# Altium schematic sheet TLV320AIC23B sch .SchDoc
size A; PageSetup: Record=PageOptions|CenterHorizontal=True|CenterVertical=True|PrintScale=1.07|XCorrection=1.00|YCorrection=1.00|PrintKind=0|BorderSize=5000000|LeftOffset=0|BottomOffset=0|Orientation=2|PaperLength=1000|PaperWidth=1000|Scale=100|PaperSource=7|PrintQuality=-4|MediaType=1|DitherType=10|PaperKind=Letter|PrintScaleMode=1
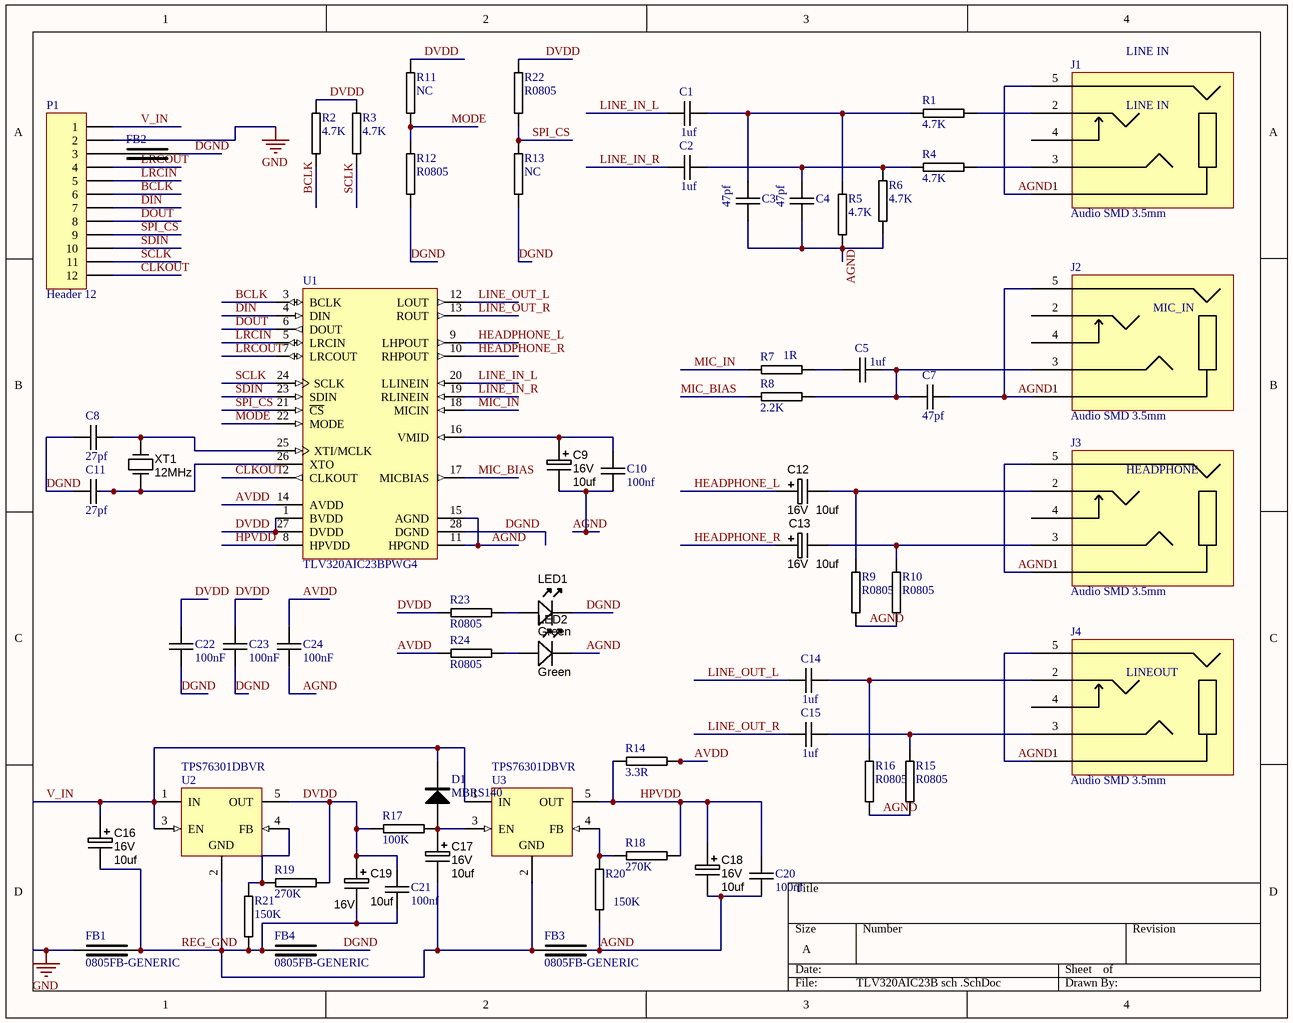
[diagram p0: TLV320AIC23B sch .SchDoc]

## Parts
C1  1uf  [0805C-GENERIC]
C2  1uf  [0805C-GENERIC]
C3  47pf  [0805C-GENERIC]
C4  47pf  [0805C-GENERIC]
C5  1uf  [0805C-GENERIC]
C7  47pf  [0805C-GENERIC]
C8  27pf  [0805C-GENERIC]
C9  Ratings: 16V  [CAPMP3528X210N]  (hidden comment: 10uf)
C10  100nf  [0805C-GENERIC]
C11  27pf  [0805C-GENERIC]
C12  Ratings: 16V  [CAPMP3528X210N]  (hidden comment: 10uf)
C13  Ratings: 16V  [CAPMP3528X210N]  (hidden comment: 10uf)
C14  1uf  [0805C-GENERIC]
C15  1uf  [0805C-GENERIC]
C16  Ratings: 16V  [CAPMP3528X210N]  (hidden comment: 10uf)
C17  Ratings: 16V  [CAPMP3528X210N]  (hidden comment: 10uf)
C18  Ratings: 16V  [CAPMP3528X210N]  (hidden comment: 10uf)
C19  Ratings: 16V  [CAPMP3528X210N]  (hidden comment: 10uf)
C20  100nf  [0805C-GENERIC]
C21  100nf  [0805C-GENERIC]
C22  100nF  [0603C-GENERIC]
C23  100nF  [0603C-GENERIC]
C24  100nF  [0603C-GENERIC]
D1  MBRS140  [DIODE-SMA]
FB1  0805FB-GENERIC  [0805FB-GENERIC]
FB2  (no value)  [0805FB-GENERIC]
FB3  0805FB-GENERIC  [0805FB-GENERIC]
FB4  0805FB-GENERIC  [0805FB-GENERIC]
J1  Audio SMD 3.5mm  [SMDAudio3.5mm]
J2  Audio SMD 3.5mm  [SMDAudio3.5mm]
J3  Audio SMD 3.5mm  [SMDAudio3.5mm]
J4  Audio SMD 3.5mm  [SMDAudio3.5mm]
LED1  Green  [LED-0805-K]
LED2  Green  [LED-0805-K]
P1  Header 12  [HDR1X12]
R1  4.7K  [0805R-GENERIC]
R2  4.7K  [0805R-GENERIC]
R3  4.7K  [0805R-GENERIC]
R4  4.7K  [0805R-GENERIC]
R5  4.7K  [0805R-GENERIC]
R6  4.7K  [0805R-GENERIC]
R7  1R  [0805R-GENERIC]
R8  2.2K  [0805R-GENERIC]
R9  R0805  [0805R-GENERIC]
R10  R0805  [0805R-GENERIC]
R11  NC  [0805R-GENERIC]
R12  R0805  [0805R-GENERIC]
R13  NC  [0805R-GENERIC]
R14  3.3R  [0805R-GENERIC]
R15  R0805  [0805R-GENERIC]
R16  R0805  [0805R-GENERIC]
R17  100K  [0805R-GENERIC]
R18  270K  [0805R-GENERIC]
R19  270K  [0805R-GENERIC]
R20  150K  [0805R-GENERIC]
R21  150K  [0805R-GENERIC]
R22  R0805  [0805R-GENERIC]
R23  R0805  [0805R-GENERIC]
R24  R0805  [0805R-GENERIC]
U1  TLV320AIC23BPWG4  [PW28_N]
U2  TPS76301DBVR  [TI-DBV5_N]
U3  TPS76301DBVR  [TI-DBV5_N]
XT1  12MHz  [CRYSTAL_HC49-US-SM]

## Nets
GND: FB1.1 P1.2
AGND: C3.1 C4.1 C7.1 C9.2 C10.2 C18.2 C20.2 C24.2 FB3.2 J1.1 J1.5 J2.1 J2.5 J3.1 J3.5 J4.1 J4.5 LED2.K R5.1 R6.1 R9.1 R10.1 R15.1 R16.1 R20.1 U1.11(HPGND) U1.15(AGND)
AVDD: C24.1 R14.2 R24.2 U1.14(AVDD)
BCLK: P1.6 R2.1 U1.3(BCLK)
CLKOUT: P1.12 U1.2(CLKOUT)
DGND: C8.1 C11.2 C22.2 C23.2 FB2.2 FB4.2 LED1.K R12.1 R13.1 U1.28(DGND)
DIN: P1.7 U1.4(DIN)
DOUT: P1.8 U1.6(DOUT)
DVDD: C19.1 C21.1 C22.1 C23.1 R2.2 R3.2 R11.2 R17.1 R19.1 R22.2 R23.2 U1.1(BVDD) U1.27(DVDD) U2.5(OUT)
HEADPHONE_L: C12.1 U1.9(LHPOUT)
HEADPHONE_R: C13.1 U1.10(RHPOUT)
HPVDD: C18.1 C20.1 R14.1 R18.1 U1.8(HPVDD) U3.5(OUT)
LINE_IN_L: C1.1 U1.20(LLINEIN)
LINE_IN_R: C2.1 U1.19(RLINEIN)
LINE_OUT_L: C14.2 U1.12(LOUT)
LINE_OUT_R: C15.2 U1.13(ROUT)
LRCIN: P1.5 U1.5(LRCIN)
LRCOUT: P1.4 U1.7(LRCOUT)
MIC_BIAS: R8.1 U1.17(MICBIAS)
MIC_IN: R7.1 U1.18(MICIN)
MODE: R11.1 R12.2 U1.22(MODE)
REG_GND: C16.2 C17.2 C19.2 C21.2 FB1.2 FB3.1 FB4.1 R21.1 U2.2(GND) U3.2(GND)
SCLK: P1.11 R3.1 U1.24(SCLK)
SDIN: P1.10 U1.23(SDIN)
SPI_CS: P1.9 R13.2 R22.1 U1.21(~{CS})
V_IN: C16.1 D1.K P1.1 U2.1(IN) U2.3(EN) U3.1(IN)
NetC1_2: C1.2 C3.2 R1.1 R5.2
NetC2_2: C2.2 C4.2 R4.1 R6.2
NetC5_1: C5.1 C7.2 J2.3 R8.2
NetC5_2: C5.2 R7.2
NetC8_2: C8.2 U1.25(XTI/MCLK) XT1.2(OUT)
NetC9_1: C9.1 C10.1 U1.16(VMID)
NetC11_1: C11.1 U1.26(XTO) XT1.1(IN)
NetC12_2: C12.2 J3.2 R9.2
NetC13_2: C13.2 J3.3 R10.2
NetC14_1: C14.1 J4.2 R16.2
NetC15_1: C15.1 J4.3 R15.2
NetC17_1: C17.1 D1.A R17.2 U3.3(EN)
NetFB2_1: FB2.1 P1.3
NetJ1_2: J1.2 R1.2
NetJ1_3: J1.3 R4.2
NetLED1_A: LED1.A R23.1
NetLED2_A: LED2.A R24.1
NetR18_2: R18.2 R20.2 U3.4(FB)
NetR19_2: R19.2 R21.2 U2.4(FB)

Not connected (* = marked no-connect by the designer): J1 4; J2 2 4; J3 4; J4 4

## Notes on the sheet
- LINE IN
- MIC_IN
- HEADPHONE
- LINEOUT

## Library data of the parts
C1-C5 C7 C8 C10 C11 C14 C15 C20 C21 = C0805-GENERIC: GENERIC CAPACITOR NON POLARISED0603
C9 C12 C13 C16-C19 = CAPT_47u_1210_6V3: Capacitor SMD Tantalum 47uF 20% 6.3V 1210; Manufacturer 1: AVX Corporation; Manufacturer Part Number 1: TCJB476M006R0070; Manufacturer Size Code: B; Voltage - Rated: 6V3; ESR (Equivalent Series Resistance): 70.0 mOhm; Type: Molded; Package / Case: 1210 (3528 Metric); Tolerance: ±20%; Material: Tantalum; Supplier 1: Digi-Key; Supplier Part Number 1: 478-3139-1-ND; Operating Temperature: -55°C ~ 125°C; Size / Dimension: 0.138" L x 0.110" W (3.50mm x 2.80mm); Height - Seated (Max): 0.083" (2.10mm); ComponentLink1URL: http://www.avx.com/docs/Catalogs/tcj.pdf; ComponentLink1Description: http://www.avx.com/docs/Catalogs/tcj.pdf; Value: 10uf
C22-C24 = 0603C-100NF-25V-X7R-TDK: CAPACITOR 0603 CERAMIC; Manufacturer Part Number: C1608X7R1E104K; Manufacturer: TDK Corporation; Reel: C12; Supplier 1: Digi-Key; Supplier Part Number 1: 445-1316-2-ND
D1 = MBRS140: DIODE; Supplier 1: Digi-Key; Supplier Part Number 1: MBRS140FSTR-ND
FB1-FB4 = 0805FB-GENERIC: FERRITE BEAD SMD
LED1 LED2 = LED_SMD_Green_0805: LED, 0805 SMD, Green; Manufacturer 1: Ligitek; Manufacturer Part Number 1: LG170G-CT; Material: GaP; Ratings: 10 mcd; 573 nm; Package / Case: 0805
P1 = Header 12: Header, 12-Pin; LatestRevisionDate: 17-Jul-2002; LatestRevisionNote: Re-released for DXP Platform.; Publisher: Altium Limited
R1-R24 = R0805-GENERIC: GENERIC RESISTOR 0805
U1 = TLV320AIC23BPWG4: Low-Power Stereo CODEC with HP Amplifier, 1 ADC and 1 DAC, 100 dB DAC SNR, 0 to 70 degC, 28-pin TSSOP (PW), Green (RoHS & no Sb/Br); Manufacturer: Texas Instruments; # ADCs (typ): 1; Battery Powered: TRUE; Control Interface: SPI, I2C; DAC SNR: 100; Digital Audio Interfaces: L, R, I2S, DSP; Sampling Rate (Max) (kHz): 96; DatasheetVersion: SLWS106H; PackageVersion: revG, Feb-2011; PackageReference: PW28; PackageDescription: 28-Pin Plastic Thin Small Outline Package 9.7 x 4.4 mm Body ,0.65 mm Pitch; Supplier 1: Digi-Key; Supplier Part Number 1: TLV320AIC23BPWG4-ND; Supplier 2: Farnell; Supplier Part Number 2: 1207297; Supplier 3: Newark; Supplier Part Number 3: 24M8317; Supplier 4: Newark; Supplier Part Number 4: 24K5643; Supplier 5: Mouser; Supplier Part Number 5: 595-TLV320AIC23BPWG4; # DACs: 1; Headphone Driver: TRUE; Mounting Technology: Surface Mount; Code_JEDEC: MO-153; PartNumber: TLV320AIC23BPWG4; ComponentLink1Description: Datasheet; ComponentLink1URL: http://www.ti.com/general/docs/lit/getliterature.tsp?genericPartNumber=TLV320AIC23B&fileType=pdf
U2 U3 = TPS76301DBVR: Single Output LDO, 150 mA, Adjustable 1.5 to 6.5 V Output, 2.7 to 10 V Input, with Low IQ, 5-pin SOT-23 (DBV), -40 to 125 degC, Green (RoHS & no Sb/Br); Manufacturer: Texas Instruments; Accuracy(%): 3; Iout(Max)(A): 0.15; Iq(Typ)(mA): 0.08; SubFamily: Single Channel LDO; Vdo(Typ)(mV): 300; Vin(Max)(V): 10; Vin(Min)(V): 2.7; Vout Adj(Max)(V): 6.5; Vout Adj(Min)(V): 1.5; DatasheetVersion: SLVS181H; PackageVersion: 4073253-4/K; PackageReference: DBV5; PackageDescription: 5-Pin Plastic Small Outline, Body 1.60 × 2.90 mm, Pitch 0.95 mm; Supplier 1: Digi-Key; Supplier Part Number 1: 296-11014-2-ND; Supplier 2: Digi-Key; Supplier Part Number 2: 296-11014-1-ND; Supplier 3: Digi-Key; Supplier Part Number 3: 296-11014-6-ND; Supplier 4: Farnell; Supplier Part Number 4: 1575735; Supplier 5: Newark; Supplier Part Number 5: 77C1028; Supplier 6: Mouser; Supplier Part Number 6: 595-TPS76301DBVR; Eco-Plan: Green (RoHS & no Sb/Br); Mounting Technology: Surface Mount; Code_JEDEC: MO-178; PartNumber: TPS76301DBVR; ComponentLink1Description: Manufacturer URL; ComponentLink1URL: http://www.ti.com/; ComponentLink2Description: Datasheet; ComponentLink2URL: http://www.ti.com/general/docs/lit/getliterature.tsp?genericPartNumber=TPS76301&fileType=pdf; ComponentLink3Description: Package Specification; ComponentLink3URL: http://www.ti.com/litv/pdf/mpds018i
XT1 = Crystal_6MHz_HC49/US: Resonator Ceramic 6.00 MHz 30ppm; Manufacturer 1: CTS-Frequency Controls; Manufacturer Part Number 1: ATS060BSM-1; Frequency: 6MHz; Frequency Stability: ±50ppm; Load Capacitance: 18pF; Operating Mode: Fundamental; Parameter Name: 0.169" (4.30mm); Package / Case: HC49/US-SM; Ratings: 6.00 MHz; Supplier 1: Digi-Key; Supplier Part Number 1: CTX882CT-ND; Type: MHz Crystal; Frequency Tolerance: ±30ppm; Operating Temperature: -20°C ~ 70°C; Mounting Type: Surface Mount; Size / Dimension: 0.437" L x 0.190" W (11.10mm x 4.83mm); ComponentLink1URL: http://www.ctscorp.com/components/Datasheets/008-0309-0.pdf; ComponentLink1Description: http://www.ctscorp.com/components/Datasheets/008-0309-0.pdf